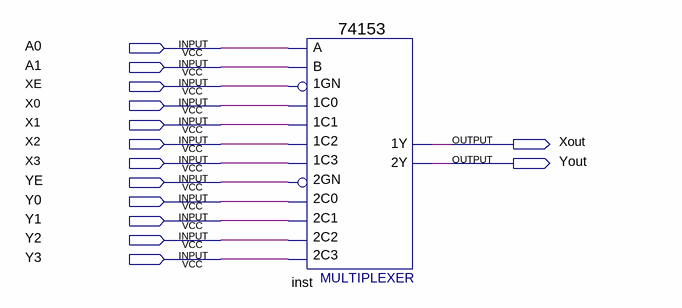
[diagram p0: schematic sheet]
// Quartus schematic sch74153.bdf as structural Verilog: 1 symbols, 14 pins
module sch74153 (
  input  A0,
  input  A1,
  input  XE,
  input  X0,
  input  X1,
  input  X2,
  input  X3,
  input  YE,
  input  Y0,
  input  Y1,
  input  Y2,
  input  Y3,
  output Xout,
  output Yout
);

  \74153  inst (
    .\1C1 (X1), .\1GN (XE), .\1C0 (X0), .\2C0 (Y0), .\2GN (YE), .\2C2 (Y2), .\1C2 (X2), .\1C3 (X3), .B(A1),
    .A(A0), .\2C1 (Y1), .\2C3 (Y3), .\1Y (Xout), .\2Y (Yout));
endmodule
